# EasyEDA schematic steemdex.json
TITLE: Steem Dex; REV: 1.0; Date: 2021-01-31; Sheet: 1/1; Drawn By: Anuchit.C; Company: -
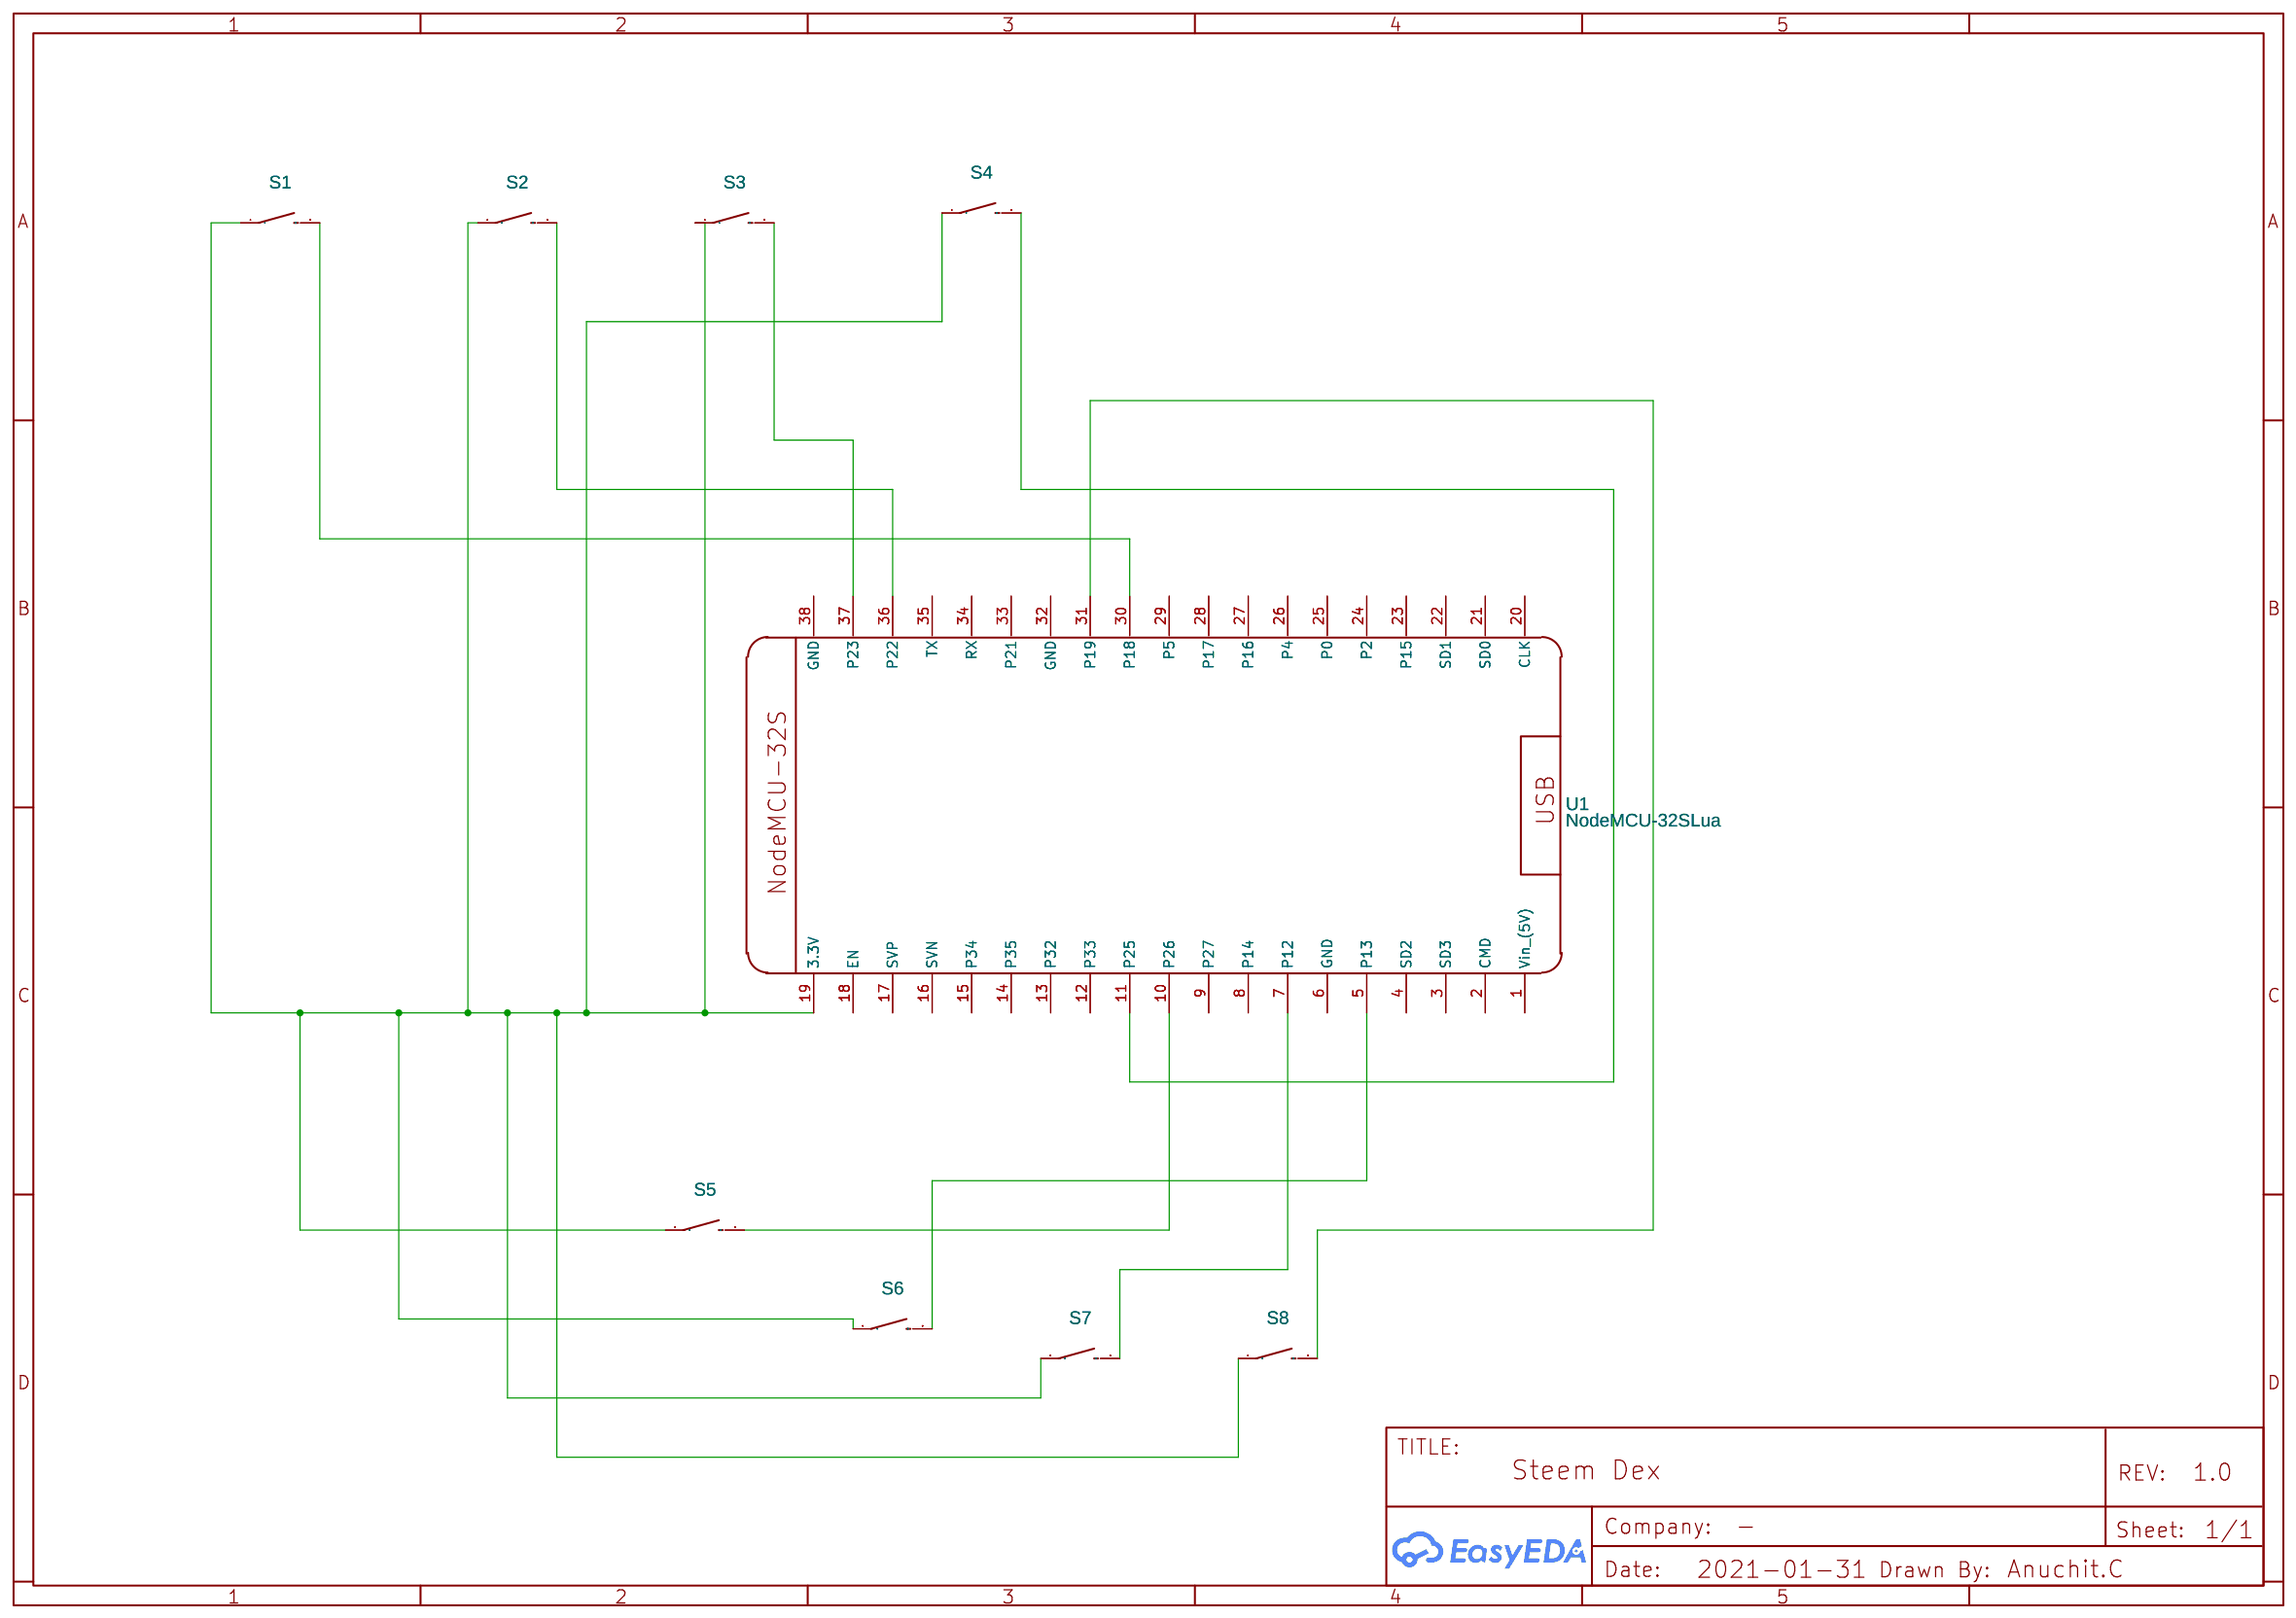
[diagram p0: schematic sheet]

## Parts
S1  MOMENTARY-SWITCH-SPST-PTH-12MM  [TACTILE_SWITCH_PTH_12MM]
S2  MOMENTARY-SWITCH-SPST-PTH-12MM  [TACTILE_SWITCH_PTH_12MM]
S3  MOMENTARY-SWITCH-SPST-PTH-12MM  [TACTILE_SWITCH_PTH_12MM]
S4  MOMENTARY-SWITCH-SPST-PTH-12MM  [TACTILE_SWITCH_PTH_12MM]
S5  MOMENTARY-SWITCH-SPST-PTH-12MM  [TACTILE_SWITCH_PTH_12MM]
S6  MOMENTARY-SWITCH-SPST-PTH-12MM  [TACTILE_SWITCH_PTH_12MM]
S7  MOMENTARY-SWITCH-SPST-PTH-12MM  [TACTILE_SWITCH_PTH_12MM]
S8  MOMENTARY-SWITCH-SPST-PTH-12MM  [TACTILE_SWITCH_PTH_12MM]
U1  NodeMCU-32SLua  [NODEMCU-32SLUA]

## Library data of the parts
S1-S8 = MOMENTARY-SWITCH-SPST-PTH-12MM: Contributor: jaki jimi
U1 = NodeMCU-32SLua: Supplier: LCSC; Supplier Part: C111436; Manufacturer: Ai-Thinker; Contributor: EasyEDA; link: https://lcsc.com/product-detail/Modules_NodeMCU-32S-Lua_C111436.html

## Nets
Net-(S1-1): S1.1 S2.1 S3.1 S4.1 S5.1 S6.1 S7.1 S8.1 U1.19(3.3V)
Net-(S1-3): S1.3(2) U1.30(P18)
Net-(S2-3): S2.3(2) U1.36(P22)
Net-(S3-3): S3.3(2) U1.37(P23)
Net-(S4-3): S4.3(2) U1.11(P25)
Net-(S5-3): S5.3(2) U1.10(P26)
Net-(S6-3): S6.3(2) U1.5(P13)
Net-(S7-3): S7.3(2) U1.7(P12)
Net-(S8-3): S8.3(2) U1.31(P19)

Not connected (* = marked no-connect by the designer): U1 1(Vin (5V)) 2(CMD) 3(SD3) 4(SD2) 6(GND) 8(P14) 9(P27) 12(P33) 13(P32) 14(P35) 15(P34) 16(SVN) 17(SVP) 18(EN) 20(CLK) 21(SD0) 22(SD1) 23(P15) 24(P2) 25(P0) 26(P4) 27(P16) 28(P17) 29(P5) 32(GND) 33(P21) 34(RX) 35(TX) 38(GND)
